# Altium project PROC106B.PrjPcb (part 2 of 2)

## Sheet PROC106B_FLASH_USB_TO_UART.SchDoc: FLASH&USB_TO_UART
size 431 x 279 mm; Date: Not shown in title block; ApprovedBy: Not shown in title block; CheckedBy: Not shown in title block; Author: Not shown in title block; CompanyName: Not shown in title block; DrawnBy: Antony/Anand Ram; Engineer: Not shown in title block; Organization: Not shown in title block; Address1: Not shown in title block; Address2: Not shown in title block; Address3: Not shown in title block; Address4: Not shown in title block; DocumentNumber: 6; Revision: Use project parameter SCH_Rev; SheetNumber: 6; SheetTotal: 12; PageSetup: Record=PageOptions|CenterHorizontal=True|CenterVertical=True|PrintScale=1.00|XCorrection=1.00|YCorrection=1.00|PrintKind=0|BorderSize=5000000|LeftOffset=0|BottomOffset=0|Orientation=2|PaperLength=1000|PaperWidth=1000|Scale=100|PaperSource=15|PrintQuality=600|MediaType=1|DitherType=10|PaperKind=Letter|PrintScaleMode=1; CurrentTime: Not shown in title block; CurrentDate: Not shown in title block; Time: Not shown in title block; DocumentFullPathAndName: Not shown in title block; DocumentName: Not shown in title block; ModifiedDate: Not shown in title block; ImagePath: Not shown in title block
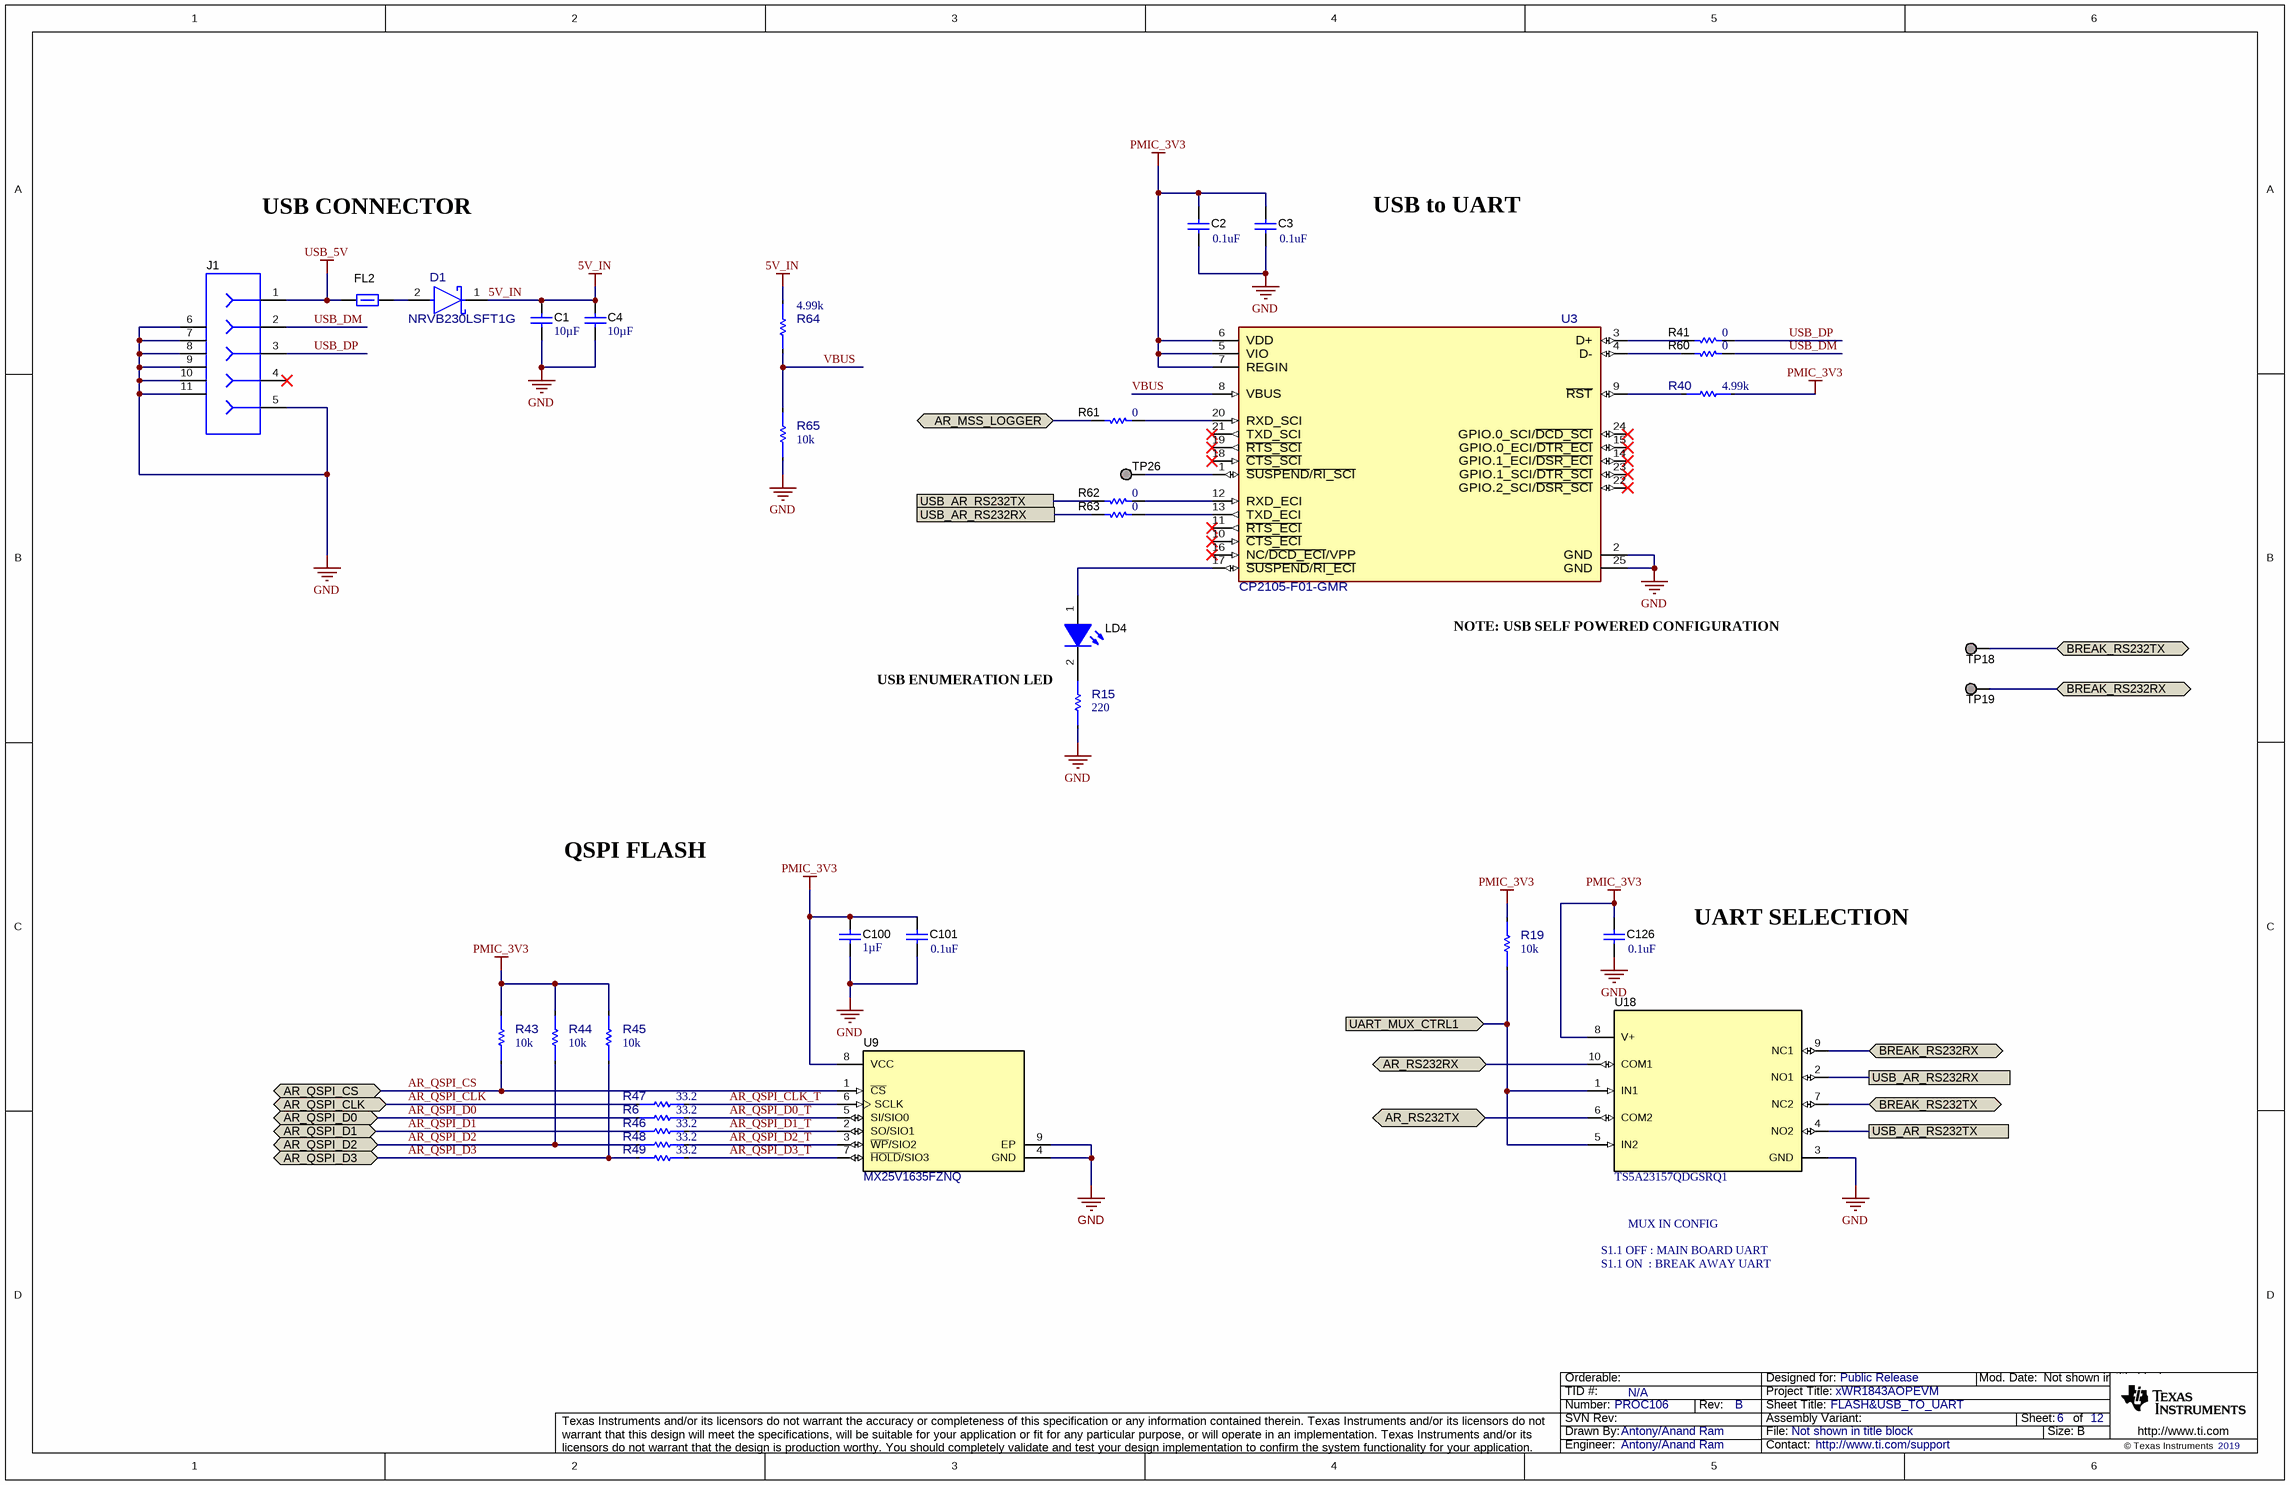
[diagram p2: PROC106B_FLASH_USB_TO_UART.SchDoc]

### Parts
C1  Cap_F: 10µF  [0805L]  (hidden comment: GCM21BR71A106KE22L)
C2  ValueDisplayed: 0.1uF  [0402L]  (hidden comment: GCM155R71C104KA55D)
C3  ValueDisplayed: 0.1uF  [0402L]  (hidden comment: GCM155R71C104KA55D)
C4  Cap_F: 10µF  [0805L]  (hidden comment: GCM21BR71A106KE22L)
C100  Cap_F: 1µF  [0603L]  (hidden comment: GCM188R71C105KA64D)
C101  ValueDisplayed: 0.1uF  [0402L]  (hidden comment: GCM155R71C104KA55D)
C126  ValueDisplayed: 0.1uF  [0402L]  (hidden comment: GCM155R71C104KA55D)
D1  NRVB230LSFT1G  [FP-NRVB230LSFT1G_SOD-123F-MFG]
FL2  BLM15PD300SZ1D  [0402L]  (value not drawn)
J1  105017-0001  [CONN_105017-0001]  (value not drawn)
LD4  APHHS1005CGCK  [APHHS1005_Green]  (value not drawn)
R6  value 33.2  [FP-ERJ-1GNF33R2C_0201-IPC_C]  (hidden comment: ERJ-1GNF33R2C)
R15  value 220  [FP-ERJ-1GNJ221C_0201-IPC_C]  (hidden comment: ERJ-1GNJ221C)
R19  value 10k  [FP-ERA-1AEB103C_0201-IPC_C]  (hidden comment: ERA-1AEB103C)
R40  value 4.99k  [FP-ERJ-1GNF4991C_0201-IPC_C]  (hidden comment: ERJ-1GNF4991C)
R41  ValueDisplayed: 0  [0201L]  (hidden comment: ERJ-1GN0R00C)
R43  value 10k  [FP-ERA-1AEB103C_0201-IPC_C]  (hidden comment: ERA-1AEB103C)
R44  value 10k  [FP-ERA-1AEB103C_0201-IPC_C]  (hidden comment: ERA-1AEB103C)
R45  value 10k  [FP-ERA-1AEB103C_0201-IPC_C]  (hidden comment: ERA-1AEB103C)
R46  value 33.2  [FP-ERJ-1GNF33R2C_0201-IPC_C]  (hidden comment: ERJ-1GNF33R2C)
R47  value 33.2  [FP-ERJ-1GNF33R2C_0201-IPC_C]  (hidden comment: ERJ-1GNF33R2C)
R48  value 33.2  [FP-ERJ-1GNF33R2C_0201-IPC_C]  (hidden comment: ERJ-1GNF33R2C)
R49  value 33.2  [FP-ERJ-1GNF33R2C_0201-IPC_C]  (hidden comment: ERJ-1GNF33R2C)
R60  ValueDisplayed: 0  [0201L]  (hidden comment: ERJ-1GN0R00C)
R61  ValueDisplayed: 0  [0201L]  (hidden comment: ERJ-1GN0R00C)
R62  ValueDisplayed: 0  [0201L]  (hidden comment: ERJ-1GN0R00C)
R63  ValueDisplayed: 0  [0201L]  (hidden comment: ERJ-1GN0R00C)
R64  value 4.99k  [FP-ERJ-1GNF4991C_0201-IPC_C]  (hidden comment: ERJ-1GNF4991C)
R65  value 10k  [FP-ERA-1AEB103C_0201-IPC_C]  (hidden comment: ERA-1AEB103C)
TP18  TESTPOINT  [TP_25MIL-SMT]  (value not drawn)  (no BOM)
TP19  TESTPOINT  [TP_25MIL-SMT]  (value not drawn)  (no BOM)
TP26  TESTPOINT  [TP_25MIL-SMT]  (value not drawn)  (no BOM)
U3  CP2105-F01-GMR  [FP-CP2105-F01-GMR_QFN24-EP-IPC_A]
U9  MX25V1635FZNQ  [WSON-8L_6x5MM_EP]
U18  TS5A23157QDGSRQ1  [DGS0010A_L]

### Ports
AR_MSS_LOGGER (bidir), AR_QSPI_CLK (bidir), AR_QSPI_CS (bidir), AR_QSPI_D0 (bidir), AR_QSPI_D1 (bidir), AR_QSPI_D2 (bidir), AR_QSPI_D3 (bidir), AR_RS232RX (bidir), AR_RS232TX (bidir), BREAK_RS232RX (bidir), BREAK_RS232TX (bidir), UART_MUX_CTRL1 (in), USB_AR_RS232RX, USB_AR_RS232TX

### Nets
5V_IN: C1.2 C4.1 D1.1(CATHODE) R64.1
GND: C1.1 C2.2 C3.2 C4.2 C100.1 C101.1 C126.1 J1.5 J1.6 J1.7 J1.8 J1.9 J1.10 J1.11 R15.1 R65.1 U3.2(GND) U3.25(GND) U9.4(GND) U9.9(EP) U18.3(GND)
PMIC_3V3: C2.1 C3.1 C100.2 C101.2 C126.2 R19.2 R40.1 R43.2 R44.2 R45.2 U3.5(VIO) U3.6(VDD) U3.7(REGIN) U9.8(VCC) U18.8(V+)
USB_5V: FL2.1 J1.1
AR_MSS_LOGGER: R61.1 ; port AR_MSS_LOGGER
AR_QSPI_CLK: R47.1 ; port AR_QSPI_CLK
AR_QSPI_CLK_T: R47.2 U9.6(SCLK)
AR_QSPI_CS: R43.1 U9.1(~{CS}) ; port AR_QSPI_CS
AR_QSPI_D0: R6.1 ; port AR_QSPI_D0
AR_QSPI_D0_T: R6.2 U9.5(SI/SIO0)
AR_QSPI_D1: R46.1 ; port AR_QSPI_D1
AR_QSPI_D1_T: R46.2 U9.2(SO/SIO1)
AR_QSPI_D2: R44.1 R48.1 ; port AR_QSPI_D2
AR_QSPI_D2_T: R48.2 U9.3(~{WP}/SIO2)
AR_QSPI_D3: R45.1 R49.1 ; port AR_QSPI_D3
AR_QSPI_D3_T: R49.2 U9.7(~{HOLD}/SIO3)
AR_RS232RX: U18.10(COM1) ; port AR_RS232RX
AR_RS232TX: U18.6(COM2) ; port AR_RS232TX
BREAK_RS232RX: TP19.1 U18.9(NC1) ; port BREAK_RS232RX
BREAK_RS232TX: TP18.1 U18.7(NC2) ; port BREAK_RS232TX
UART_MUX_CTRL1: R19.1 U18.1(IN1) U18.5(IN2) ; port UART_MUX_CTRL1
USB_AR_RS232RX: R63.1 U18.2(NO1) ; port USB_AR_RS232RX
USB_AR_RS232TX: R62.1 U18.4(NO2) ; port USB_AR_RS232TX
USB_DM: J1.2 R60.2
USB_DP: J1.3 R41.2
VBUS: R64.2 R65.2 U3.8(VBUS)
NetD1_2: D1.2(ANODE) FL2.2
NetLD4_1: LD4.1(A) U3.17(~{SUSPEND}/~{RI_ECI})
NetLD4_2: LD4.2(K) R15.2
NetR40_2: R40.2 U3.9(~{RST})
NetR41_1: R41.1 U3.3(D+)
NetR60_1: R60.1 U3.4(D-)
NetR61_2: R61.2 U3.20(RXD_SCI)
NetR62_2: R62.2 U3.12(RXD_ECI)
NetR63_2: R63.2 U3.13(TXD_ECI)
NetTP26_1: TP26.1 U3.1(~{SUSPEND}/~{RI_SCI})

Not connected (* = marked no-connect by the designer): J1 4*; U3 10(~{CTS_ECI})* 11(~{RTS_ECI})* 14(GPIO.1_ECI/~{DSR_ECI})* 15(GPIO.0_ECI/~{DTR_ECI})* 16(NC/~{DCD_ECI}/VPP)* 18(~{CTS_SCI})* 19(~{RTS_SCI})* 21(TXD_SCI)* 22(GPIO.2_SCI/~{DSR_SCI})* 23(GPIO.1_SCI/~{DTR_SCI})* 24(GPIO.0_SCI/~{DCD_SCI})*

### Notes on the sheet
- USB CONNECTOR
- USB to UART
- (near U3) NOTE: USB SELF POWERED CONFIGURATION
- USB ENUMERATION LED
- QSPI FLASH
- UART SELECTION
- MUX IN CONFIG
- S1.1 ON  : BREAK AWAY UART
- S1.1 OFF : MAIN BOARD UART
- Drawn By:
- SVN Rev:
- Number:
- TID #:
- Orderable:
- Rev:
- Sheet Title:
- File:
- Project Title:
- Designed for:
- Assembly Variant:
- Mod. Date:
- Sheet:
- Size:
- of
- B
- http://www.ti.com
- Texas Instruments and/or its licensors do not warrant the accuracy or completeness of this specification or any information contained therein. Texas Instruments and/or its licensors do not warrant that this design will meet the specifications, will be suitable for your application or fit for any particular purpose, or will operate in an implementation. Texas Instruments and/or its licensors do not warrant that the design is production worthy. You should completely validate and test your design implementation to confirm the system functionality for your application.
- Engineer:
- Contact:
- © Texas Instruments

### Library data of the parts
C1 C4 = CMP-0008017-2: CAP, CERM, 10 uF, 10 V, +/- 10%, X7R, 0805; Manufacturer: MuRata; Value: 10uF; AEC Category: Q200; Cap_Case: 0805; Polarized: N; SizeArea_mm2: 2.5; SizeAreaWB_mm2: 6.75; SizeX_mm: 2; SizeY_mm: 1.25; SizeZ_mm: 1.45; TaMax_C: 125°C; TaMin_C: -55°C; U/M: EA; Value1: Unknown; Value2: 10V; RoHS: Y; AEC Qualified: ?; ComponentLink1Description: Datasheet link; ComponentLink1URL: http://www.murata.com/products/catalog/pdf/c03e.pdf; CompType: Capacitor; MountType: SMT; PackageReference: 0805; PartNumber: GCM21BR71A106KE22L; Supplier 1: Digi-Key; Supplier 2: Newark; Supplier 3: Mouser; Supplier Part Number 1: 490-10674-1-ND; Supplier Part Number 2: 06AC6014; Supplier Part Number 3: 81-GCM21BR71A106KE2L; Technology: Ceramic; TempCo: X7R; Tolerance_%: 10%; ValueDisplayed: 10uF; VDC_V: 10V; LatestRevisionDate: 2017-03-09; Published: 2008-06-19; Publisher: Texas Instruments
C2 C3 C101 C126 = CMP-0006351-2: CAP, CERM, 0.1 uF, 16 V, +/- 10%, X7R, 0402; Manufacturer: MuRata; Cap_F: 100nF; SizeZ_mm: 0.6; VDC_V: 16V; AEC Category: Q200; Cap_Case: 0402; Polarized: N; SizeArea_mm2: 0.5; SizeAreaWB_mm2: 3; SizeX_mm: 1; TaMax_C: 125°C; TaMin_C: -55°C; U/M: EA; Value1: Unknown; Value: 0.1uF; RoHS: Y; AEC Qualified: ?; ComponentLink1Description: Datasheet link; ComponentLink1URL: http://psearch.murata.com/capacitor/product/GCM155R71C104KA55%23.pdf; PackageReference: 0402; PartNumber: GCM155R71C104KA55D; TempCo: X7R; Tolerance_%: 10%; CompType: Capacitor; MountType: SMT; SizeY_mm: 0.5; Supplier 1: Digi-Key; Supplier Part Number 1: 490-4759-2-ND; Technology: Ceramic; Value2: 16V; LatestRevisionDate: 2017-03-09; Published: 2008-06-19; Publisher: Texas Instruments
C100 = CMP-0007136-5: CAP, CERM, 1 uF, 16 V, +/- 10%, X7R, AEC-Q200 Grade 1, 0603; Manufacturer: MuRata; AEC Qualified: Y; SizeZ_mm: 1; VDC_V: 16V; AEC Category: Q200; Cap_Case: 0603; Polarized: N; SizeArea_mm2: 1.28; SizeAreaWB_mm2: 4.68; SizeX_mm: 1.6; SizeY_mm: 0.8; TaMax_C: 125°C; TaMin_C: -55°C; U/M: EA; Value1: Unknown; Value: 1uF; RoHS: Y; ComponentLink1Description: Datasheet link; ComponentLink1URL: http://psearch.en.murata.com/capacitor/product/GCM188R71C105KA64%23.pdf; PackageReference: 0603; PartNumber: GCM188R71C105KA64D; TempCo: X7R; Tolerance_%: 10%; AEC Grade: 1; CompType: Capacitor; MountType: SMT; Supplier 1: Digi-Key; Supplier 2: Mouser; Supplier Part Number 1: 490-5241-6-ND; Supplier Part Number 2: 81-GCM188R71C105K64D; Technology: Ceramic; Value2: 16V; ValueDisplayed: 1uF; LatestRevisionDate: 2017-03-09; Published: 2008-06-19; Publisher: Texas Instruments
D1 = CMP-0090508-1: Diode Schottky 30V 2A Surface Mount SOD-123FL; Manufacturer: ON Semiconductor; TJmax_C: 125°C; SizeZ_mm: 0.98mm; AEC Qualified: Yes; AEC Grade: Grade 1; Max Surge Forward Current: 40A; Peak Reverse Current: 1mA; Standoff Height: 0mm; PackageReference: SOD-123F; RoHS: TRUE; PartNumber: NRVB230LSFT1G; ComponentLink1Description: Datasheet; Vr_V: 30V; ComponentLink1URL: https://www.onsemi.com/pub/Collateral/MBR230LSFT1-D.PDF; Vf_V: 30V; datasheet: https://www.onsemi.com/pub/Collateral/MBR230LSFT1-D.PDF; Datasheet Path: datasheets/Diode-NRVB230LSFT1G.pdf; Digikey Description: DIODE SCHOTTKY 30V 2A SOD123FL; Digikey Part Number: NRVB230LSFT1GOSCT-ND; Forward Current: 2A; helpURL: https://upverter.com/upn/revision/b5ae5ffadf60f179/; Lead Free: Yes; Mouser Description: Schottky Diodes & Rectifiers 2A 30V SCHOTTKY; Mouser Part Number: 863-NRVB230LSFT1G; Operating Temperature Range: -55°C to +125°C; Part Number: NRVB230LSFT1G
FL2 = CMP-0078934-1: Inductor, Ferrite Bead, Ferrite, 2.2 A, 0.035 ohm, AEC-Q200 Grade 1, SMD; Manufacturer: MuRata; AEC Category: Q200; AEC Grade: 1; AEC Qualified: Y; DCR_ohm: 0.035; Imax_A: 2.2A; SizeArea_mm2: 0.5; SizeAreaWB_mm2: 3; SizeZ_mm: 0.6; RoHS: Y; ComponentLink1Description: Datasheet link; ComponentLink1URL: https://www.murata.com/en-us/products/productdata/8796748677150/QNFA9118.pdf; CompType: Inductor; LatestRevisionDate: 2017-12-07; Material: Ferrite; MountType: SMT; PackageReference: 0402; PartNumber: BLM15PD300SZ1D; Published: 2008-06-26; Publisher: Texas Instruments; SizeX_mm: 1; SizeY_mm: 0.5; Supplier 1: Digi-Key; Supplier 2: Mouser; Supplier Part Number 1: 490-16506-1-ND; Supplier Part Number 2: 81-BLM15PD300SZ1D; Technology: Ferrite Bead; Value1: 0.035 ohm; Value2: 2.2A
J1 = CMP-0055293-1: Connector, Receptacle, Micro-USB Type B, R/A, Bottom Mount SMT; Manufacturer: Molex; CNHeader: FALSE; CompType: USB; CT: TRUE; Gender: Female; Green_Lifecycle: Active; Green_REACh: Passed; RoHS: Y; ComponentLink1Description: Datasheet URL; ComponentLink1URL: http://www.molex.com/pdm_docs/sd/1050170001_sd.pdf; Green_EU RoHS-2: Passed; Green_EU RoHS: Passed; LatestRevisionDate: 26/05/2017; MountType: SMT; PackageReference: Micro USB receptacle; PartNumber: 105017-0001; Publisher: Texas Instruments; Supplier 1: Digi-Key; Supplier 2: Newark; Supplier 3: Mouser; Supplier Part Number 1: WM1399CT-ND; Supplier Part Number 2: 78R1699; Supplier Part Number 3: 538-105017-0001
LD4 = CMP-0067682-2: LED, Green, SMD; Manufacturer: Kingbright; Angle: 120.0; Power_TotalModule: 75mW; SizeZ_mm: 0.6; Vf_V: 2.1V; Vr_V: 5V; Io_A: 20mA; Ir_A: 10µA; SizeArea_mm2: 0.5; SizeAreaWB_mm2: 3.0; SizeX_mm: 1.0; Tjmax_C: 85°C; Value1: 0.075W; RoHS: Y; Color: Green; ComponentLink1Description: Datasheet link; ComponentLink1URL: http://www.kingbrightusa.com/images/catalog/SPEC/APHHS1005CGCK.pdf; PackageReference: 0402; PartNumber: APHHS1005CGCK; CompType: LED; MountType: SMT; SizeY_mm: 0.5; Type: ?; Value2: 2.1V; Value: Green
R6 R46-R49 = CMP-0089575-2: Res Thick Film 0201 33.2 Ohm 1% 0.05W(1/20W) ±200ppm/C Pad SMD Automotive T/R; Manufacturer: Panasonic; AEC Grade: Grade 1; AEC Qualified: Yes; Power_W: 50mW; SizeZ_mm: 0.26mm; TempCo: 200ppm/°C; VDC_V: 25V; RoHS: TRUE; ComponentLink1Description: Datasheet; ComponentLink1URL: https://industrial.panasonic.com/cdbs/www-data/pdf/RDA0000/AOA0000C304.pdf; PackageReference: 0201; PartNumber: ERJ-1GNF33R2C; Res_ohm: 33.2; Supplier 1: Digikey; Supplier 2: Mouser; Supplier Part Number 1: P122945CT-ND; Supplier Part Number 2: 667-ERJ-1GNF33R2C; Technology: Thick Film; Tolerance_%: 1%; datasheet: https://industrial.panasonic.com/cdbs/www-data/pdf/RDA0000/AOA0000C304.pdf; Datasheet Path: datasheets/Res-ERJ-1GNF33R2C.pdf; Digikey Description: RES SMD 33.2 OHM 1% 1/20W 0201; Digikey Part Number: P122945CT-ND; helpURL: https://upverter.com/upn/revision/804e6f7ea13c6b2c/; Lead Free: Yes; Mouser Description: Thick Film Resistors - SMD 0201 33.2ohm 1% HalogenFree AEC-Q200; Mouser Part Number: 667-ERJ-1GNF33R2C; Operating Temperature Range: -55°C to +125°C; Part Number: ERJ-1GNF33R2C; Series: ERJ
R15 = CMP-0090501-1: 220 Ohms ±5% 0.05W, 1/20W Chip Resistor 0201 (0603 Metric) Automotive AEC-Q200 Thick Film; Manufacturer: Panasonic Electronic Components; AEC Grade: Grade 1; AEC Qualified: Yes; Power_W: 50mW; SizeZ_mm: 0.26mm; TempCo: 200ppm/°C; VDC_V: 25V; RoHS: TRUE; ComponentLink1Description: Datasheet; ComponentLink1URL: https://industrial.panasonic.com/cdbs/www-data/pdf/RDA0000/AOA0000C301.pdf; PackageReference: 0201; PartNumber: ERJ-1GNJ221C; Res_ohm: 220; Supplier 1: Digikey; Supplier 2: Mouser; Supplier Part Number 1: P123276CT-ND; Supplier Part Number 2: 667-ERJ-1GNJ221C; Technology: Thick Film; Tolerance_%: 5%; datasheet: https://industrial.panasonic.com/cdbs/www-data/pdf/RDA0000/AOA0000C301.pdf; Datasheet Path: datasheets/Res-ERJ-1GNJ221C.pdf; Digikey Description: RES SMD 220 OHM 5% 1/20W 0201; Digikey Part Number: P123276CT-ND; helpURL: https://upverter.com/upn/revision/fb526d048c4bdd68/; Lead Free: Yes; Mouser Description: Thick Film Resistors - SMD 0201 220ohms 5% Thick Film Resistor; Mouser Part Number: 667-ERJ-1GNJ221C; Operating Temperature Range: -55°C to +125°C; Part Number: ERJ-1GNJ221C; Series: ERJ
R19 R43-R45 R65 = CMP-0090084-1: RES SMD 10K OHM 0.1% 1/20W 0201; Manufacturer: Panasonic; AEC Qualified: No; Power_W: 50mW; SizeZ_mm: 0.26mm; TempCo: 25ppm/°C; VDC_V: 25V; RoHS: TRUE; ComponentLink1Description: Datasheet; ComponentLink1URL: https://industrial.panasonic.com/cdbs/www-data/pdf/RDM0000/AOA0000C307.pdf; PackageReference: 0201; PartNumber: ERA-1AEB103C; Res_ohm: 10k; Technology: Thin Film; Tolerance_%: 0.1%; datasheet: https://industrial.panasonic.com/cdbs/www-data/pdf/RDM0000/AOA0000C307.pdf; Datasheet Path: datasheets/Res-ERA-1AEB103C.pdf; Digikey Description: RES SMD 10K OHM 0.1% 1/20W 0201; Digikey Part Number: P10KBXCT-ND; helpURL: https://upverter.com/upn/revision/ad75fa42d92ba837/; Lead Free: Yes; Mouser Part Number: 667-ERA-1AEB103C; Operating Temperature Range: -55°C to +155°C; Part Number: ERA-1AEB103C; Series: ERA; Supplier 1: Digikey; Supplier 2: Mouser; Supplier Part Number 1: P10KBXCT-ND; Supplier Part Number 2: 667-ERA-1AEB103C
R40 R64 = CMP-0090497-1: 4.99 kOhms ±1% 0.05W, 1/20W Chip Resistor 0201 (0603 Metric) Automotive AEC-Q200 Thick Film; Manufacturer: Panasonic Electronic Components; AEC Grade: Grade 1; AEC Qualified: Yes; Power_W: 50mW; SizeZ_mm: 0.26mm; TempCo: 200ppm/°C; VDC_V: 25V; RoHS: TRUE; ComponentLink1Description: Datasheet; ComponentLink1URL: https://industrial.panasonic.com/cdbs/www-data/pdf/RDA0000/AOA0000C304.pdf; PackageReference: 0201; PartNumber: ERJ-1GNF4991C; Res_ohm: 4.99k; Supplier 1: Digikey; Supplier 2: Mouser; Supplier Part Number 1: P123046CT-ND; Supplier Part Number 2: 667-ERJ-1GNF4991C; Technology: Thick Film; Tolerance_%: 1%; datasheet: https://industrial.panasonic.com/cdbs/www-data/pdf/RDA0000/AOA0000C304.pdf; Datasheet Path: datasheets/Res-ERJ-1GNF4991C.pdf; Digikey Description: RES SMD 4.99K OHM 1% 1/20W 0201; Digikey Part Number: P123046CT-ND; helpURL: https://upverter.com/upn/revision/2e32c60b077f8dd5/; Lead Free: Yes; Mouser Description: Thick Film Resistors - SMD 0201 4.99Kohm 1% HalogenFree AEC-Q200; Mouser Part Number: 667-ERJ-1GNF4991C; Operating Temperature Range: -55°C to +125°C; Part Number: ERJ-1GNF4991C; Series: ERJ
R41 R60-R63 = CMP-0065361-1: RES, 0, 5%, .05 W, AEC-Q200 Grade 0, 0201; Manufacturer: Panasonic; AEC Qualified: Y; Power_W: 50mW; SizeZ_mm: 0.26; TempCo: ppm/C; AEC Category: Q200; EIA_Code: E24; Green_Lifecycle: Not Set; Green_REACh: Incomplete; SizeArea_mm2: 0.18; SizeX_mm: 0.6; SizeY_mm: 0.3; U/M: EA; Value2: .05W; Value: 0; Value_Code: 0000; RoHS: Y; ComponentLink1Description: Datasheet link; ComponentLink1URL: https://industrial.panasonic.com/cdbs/www-data/pdf/RDA0000/AOA0000C281.pdf; PackageReference: 0201; PartNumber: ERJ-1GN0R00C; Res_ohm: 0; Technology: Thick Film; Tolerance_%: 5%; AEC Grade: 0; CompType: Resistor; Green_EU RoHS-2: Incomplete; Green_EU RoHS: Incomplete; LatestRevisionDate: 2017-06-05; MountType: SMT; Published: 2016-10-14; Publisher: Texas Instruments; Supplier 1: Digi-Key; Supplier 2: Newark; Supplier 3: Mouser; Supplier Part Number 1: P15979CT-ND; Supplier Part Number 2: 51W5934; Supplier Part Number 3: 667-ERJ-1GN0R00C; Value1: 5%
TP18 TP19 TP26 = CMP-0078143-3: TEST POINT.  No entry in BOM.; CompType: Testpoint; Manufacturer: N/A; PackageReference: N/A; PartNumber: N/A; Library Reference: TESTPOINT
U3 = CMP-0087172-1: I/O Controller Interface IC USB to Dual UART bridge; Manufacturer: Silicon Labs; SizeZ_mm: 0.8mm; RoHS: TRUE; ComponentLink1Description: Datasheet; ComponentLink1URL: https://www.silabs.com/documents/public/data-sheets/CP2105.pdf; PackageReference: QFN24-EP; PartNumber: CP2105-F01-GMR; Symbol Name: SYM-CP2105-F01-GMR
U9 = CMP-0079267-1: 2.3V-3.6V, 16M-BIT [x 1/x 2/x 4] CMOS FLASH Memory, WSON-8; Manufacturer: Macronix International Co., LTD; SizeArea_mm2: 30; SizeAreaWB_mm2: 56; SizeX_mm: 6; SizeY_mm: 5; SizeZ_mm: 0.8; RoHS: Y; ComponentLink1Description: Datasheet URL; ComponentLink1URL: http://www.macronix.com/Lists/Datasheet/Attachments/6724/MX25V1635F,%202.5V,%2016Mb,%20v1.4.pdf; MountType: SMT; PackageReference: WSON-8; PartNumber: MX25V1635FZNQ; Supplier 1: Digi-Key; Supplier Part Number 1: 1092-1211-ND
U18 = CMP-0074341-1: Automotive Catalog Dual 15-Ohm SPDT Analog Switch, DGS0010A (VSSOP-10); Alternate Manufacturer: Texas Instruments; CompType: IC; SizeArea_mm2: 14.7; SizeAreaWB_mm2: 23.6; SizeX_mm: 4.9; SizeY_mm: 3.0; SizeZ_mm: 1.1; U/M: EA; RoHS: Y; ComponentLink1Description: Datasheet Link; ComponentLink1URL: http://www.ti.com/lit/ds/symlink/ts5a23157-q1.pdf; Footprint Path 6: C:\AltiumLibraries\Footprints\TI\.PcbLib; LatestRevisionDate: 2017-06-09; Manufacturer: Texas Instruments; MountType: SMT; PackageDescription: VSSOP-10; PackageReference: DGS0010A; PartNumber: TS5A23157QDGSRQ1; Publisher: Texas Instruments

## Sheet PROC106B_RST_GPIOs_I2C.SchDoc: BREAKAWAY_SECTION2
size 431 x 279 mm; Date: Not shown in title block; ApprovedBy: Not shown in title block; CheckedBy: Not shown in title block; Author: Not shown in title block; CompanyName: Not shown in title block; DrawnBy: Antony/Anand Ram; Engineer: Not shown in title block; Organization: Not shown in title block; Address1: Not shown in title block; Address2: Not shown in title block; Address3: Not shown in title block; Address4: Not shown in title block; DocumentNumber: 8; Revision: Use project parameter SCH_Rev; SheetNumber: 8; SheetTotal: 12; PageSetup: Record=PageOptions|CenterHorizontal=True|CenterVertical=True|PrintScale=1.00|XCorrection=1.00|YCorrection=1.00|PrintKind=0|BorderSize=5000000|LeftOffset=0|BottomOffset=0|Orientation=2|PaperLength=1000|PaperWidth=1000|Scale=100|PaperSource=15|PrintQuality=600|MediaType=1|DitherType=10|PaperKind=Letter|PrintScaleMode=1; CurrentTime: Not shown in title block; CurrentDate: Not shown in title block; Time: Not shown in title block; DocumentFullPathAndName: Not shown in title block; DocumentName: Not shown in title block; ModifiedDate: Not shown in title block; ImagePath: Not shown in title block
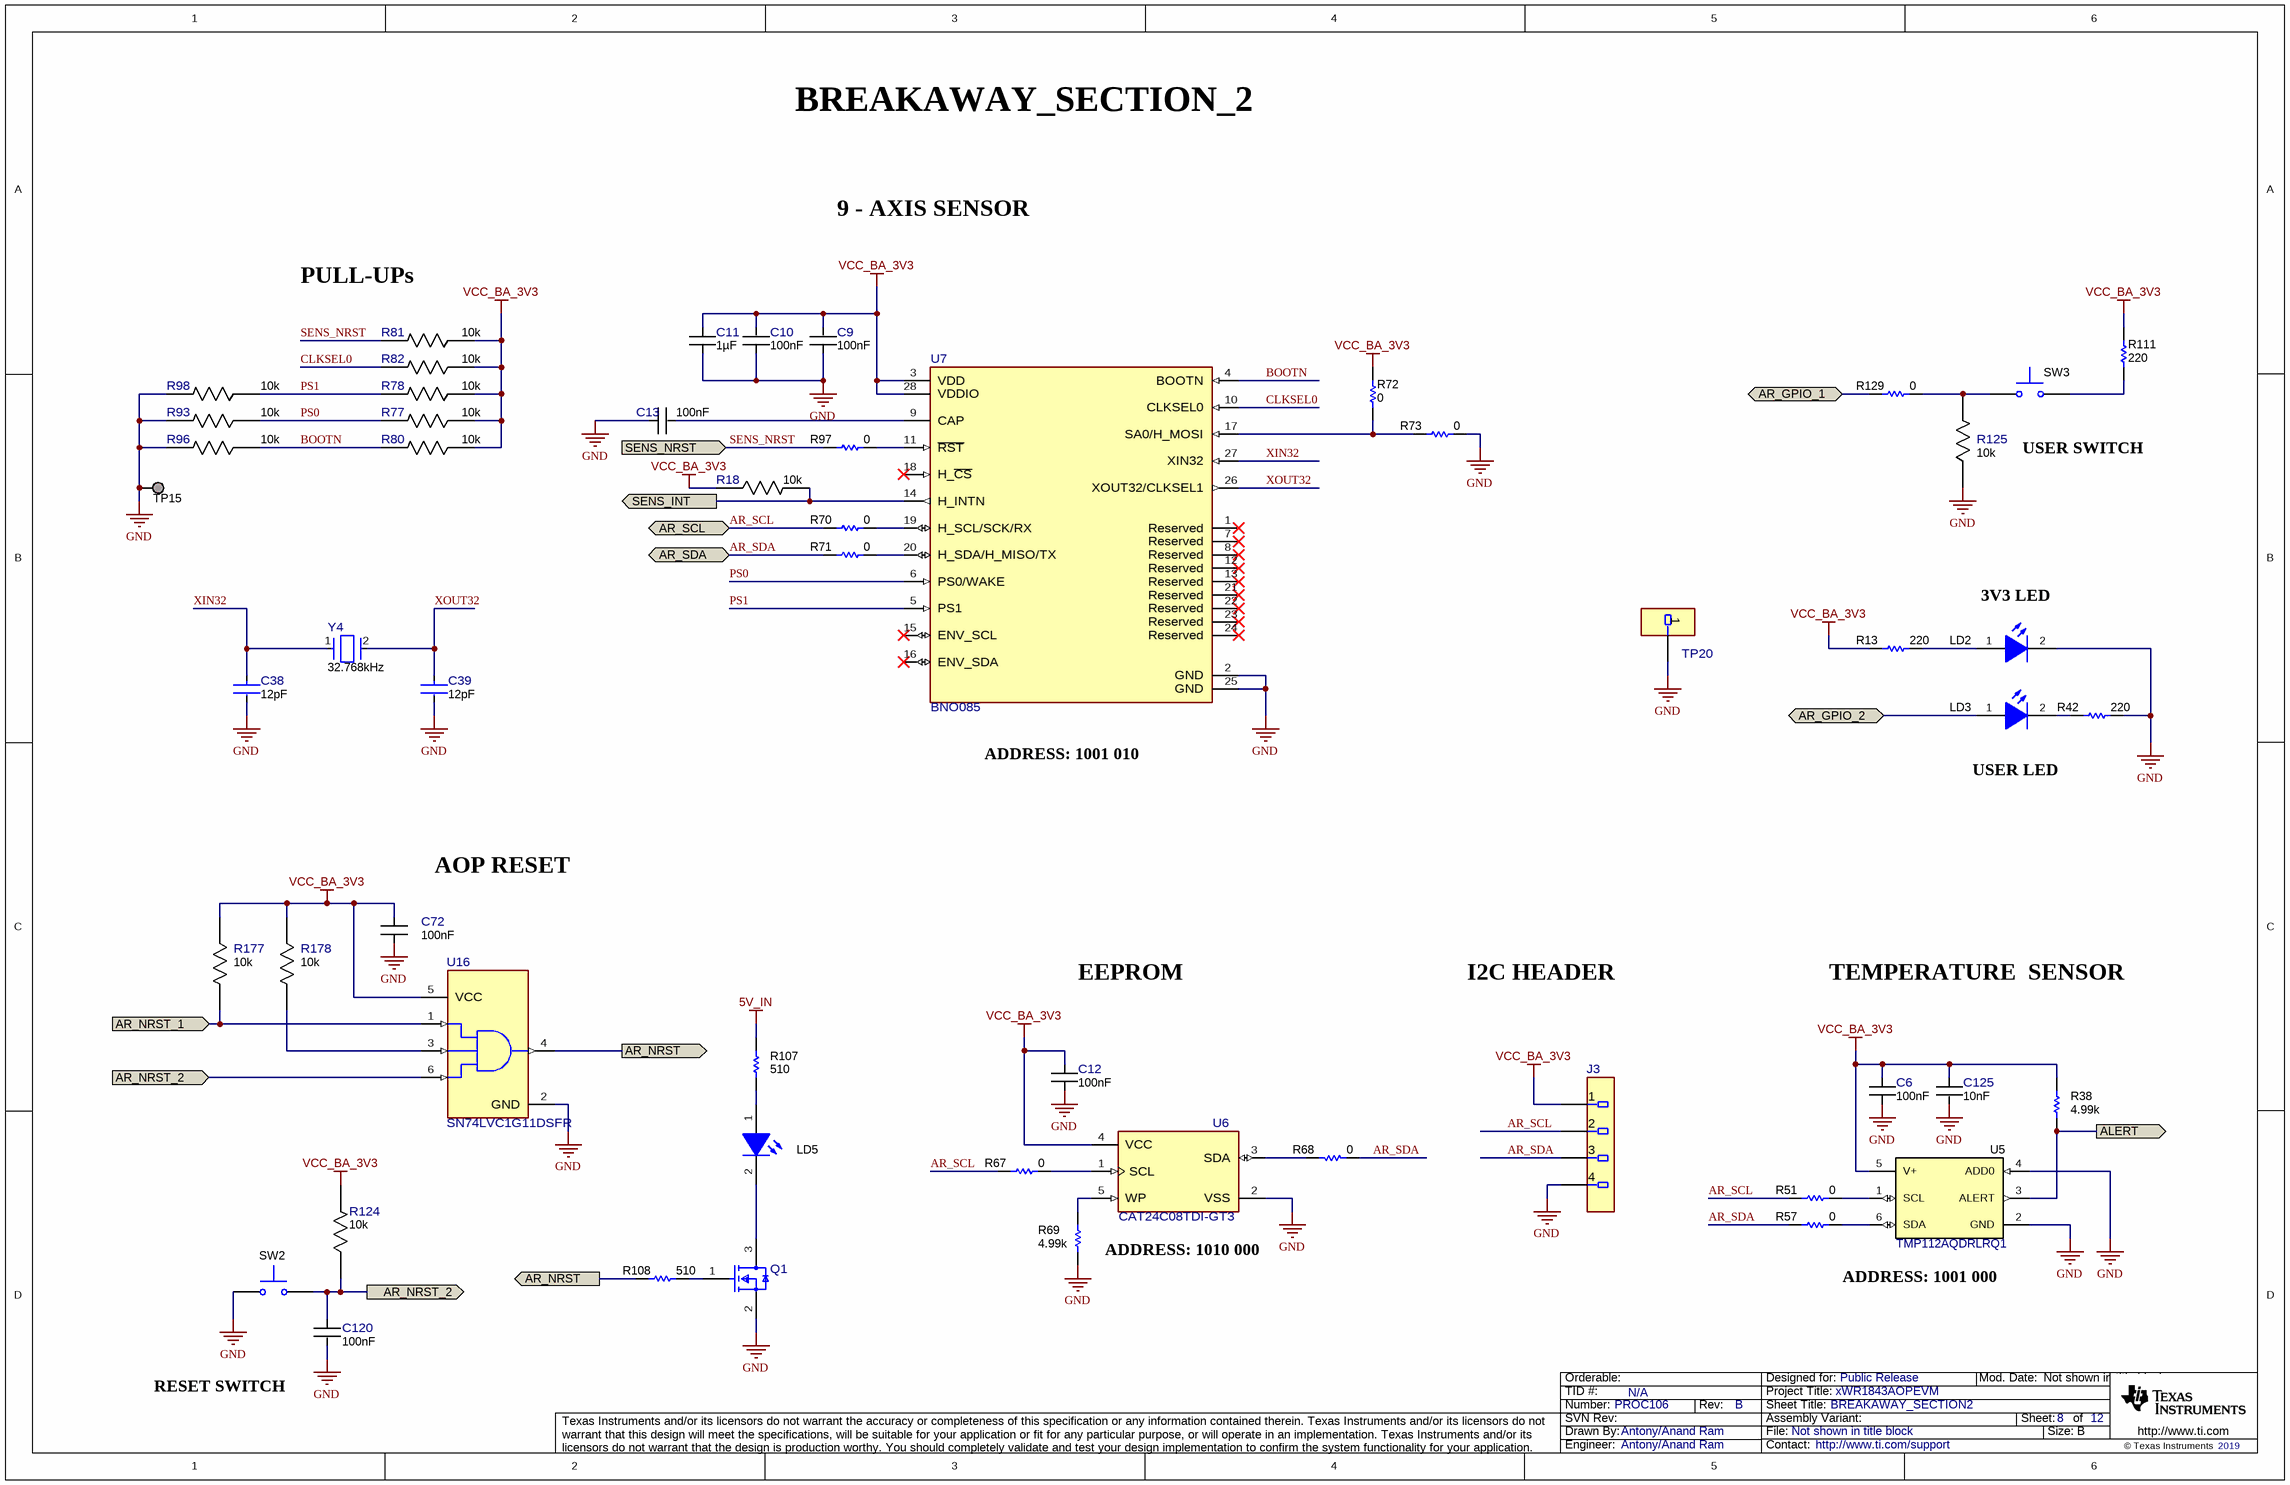
[diagram p3: PROC106B_RST_GPIOs_I2C.SchDoc]

### Parts
C6  Cap_F: 100nF  [FP-GRM033R6YA104KE14D_0201 (0603 Metric)-IPC_C]  (hidden comment: GRM033R6YA104KE14D)
C9  Cap_F: 100nF  [FP-GRM033R6YA104KE14D_0201 (0603 Metric)-IPC_C]  (hidden comment: GRM033R6YA104KE14D)
C10  Cap_F: 100nF  [FP-GRM033R6YA104KE14D_0201 (0603 Metric)-IPC_C]  (hidden comment: GRM033R6YA104KE14D)
C11  Cap_F: 1µF  [FP-CL03A105MO3NRNH_0201-IPC_C]  (hidden comment: CL03A105MO3NRNH)
C12  Cap_F: 100nF  [FP-GRM033R6YA104KE14D_0201 (0603 Metric)-IPC_C]  (hidden comment: GRM033R6YA104KE14D)
C13  Cap_F: 100nF  [FP-GRM033R6YA104KE14D_0201 (0603 Metric)-IPC_C]  (hidden comment: GRM033R6YA104KE14D)
C38  Cap_F: 12pF  [FP-250R05L120JV4T_0201-IPC_C]  (hidden comment: 250R05L120JV4T)
C39  Cap_F: 12pF  [FP-250R05L120JV4T_0201-IPC_C]  (hidden comment: 250R05L120JV4T)
C72  Cap_F: 100nF  [FP-GRM033R6YA104KE14D_0201 (0603 Metric)-IPC_C]  (hidden comment: GRM033R6YA104KE14D)
C120  Cap_F: 100nF  [FP-GRM033R6YA104KE14D_0201 (0603 Metric)-IPC_C]  (hidden comment: GRM033R6YA104KE14D)
C125  Cap_F: 10nF  [FP-CL03A103KA3NNNC_0201-IPC_C]  (hidden comment: CL03A103KA3NNNC)
J3  M50-3930442  [FP-M50-3930442_HDR4-Recommended_Land_Pattern]  (value not drawn)
LD2  APHHS1005CGCK  [APHHS1005_Green]  (value not drawn)
LD3  APHHS1005CGCK  [APHHS1005_Green]  (value not drawn)
LD5  APHHS1005CGCK  [APHHS1005_Green]  (value not drawn)
Q1  BSS123-7-F  [FP-BSS123-7-F_SOT23-IPC_C]  (value not drawn)
R13  value 220  [0201L]  (hidden comment: RC0201JR-07220RL)
R18  Res_ohm: 10k  [FP-RR0306P-103-D_0201-IPC_C]  (hidden comment: RR0306P-103-D)
R38  value 4.99k  [0201L]  (hidden comment: RC0201FR-074K99L)
R42  value 220  [0201L]  (hidden comment: RC0201JR-07220RL)
R51  Res_ohm: 0  [FP-RC0201JR-070RL_0201 (0603 Metric)-MFG]  (hidden comment: RC0201JR-070RL)
R57  Res_ohm: 0  [FP-RC0201JR-070RL_0201 (0603 Metric)-MFG]  (hidden comment: RC0201JR-070RL)
R67  Res_ohm: 0  [FP-RC0201JR-070RL_0201 (0603 Metric)-MFG]  (hidden comment: RC0201JR-070RL)
R68  Res_ohm: 0  [FP-RC0201JR-070RL_0201 (0603 Metric)-MFG]  (hidden comment: RC0201JR-070RL)
R69  value 4.99k  [0201L]  (hidden comment: RC0201FR-074K99L)
R70  Res_ohm: 0  [FP-RC0201JR-070RL_0201 (0603 Metric)-MFG]  (hidden comment: RC0201JR-070RL)
R71  Res_ohm: 0  [FP-RC0201JR-070RL_0201 (0603 Metric)-MFG]  (hidden comment: RC0201JR-070RL)
R72  Res_ohm: 0  [FP-RC0201JR-070RL_0201 (0603 Metric)-IPC_C]  (hidden comment: RC0201JR-070RL)
R73  Res_ohm: 0  [FP-RC0201JR-070RL_0201 (0603 Metric)-IPC_C]  (hidden comment: RC0201JR-070RL)
R77  Res_ohm: 10k  [FP-RR0306P-103-D_0201-IPC_C]  (hidden comment: RR0306P-103-D)
R78  Res_ohm: 10k  [FP-RR0306P-103-D_0201-IPC_C]  (hidden comment: RR0306P-103-D)
R80  Res_ohm: 10k  [FP-RR0306P-103-D_0201-IPC_C]  (hidden comment: RR0306P-103-D)
R81  Res_ohm: 10k  [FP-RR0306P-103-D_0201-IPC_C]  (hidden comment: RR0306P-103-D)
R82  Res_ohm: 10k  [FP-RR0306P-103-D_0201-IPC_C]  (hidden comment: RR0306P-103-D)
R93  Res_ohm: 10k  [FP-RR0306P-103-D_0201-IPC_C]  (hidden comment: RR0306P-103-D)
R96  Res_ohm: 10k  [FP-RR0306P-103-D_0201-IPC_C]  (hidden comment: RR0306P-103-D)
R97  Res_ohm: 0  [FP-RC0201JR-070RL_0201 (0603 Metric)-IPC_C]  (hidden comment: RC0201JR-070RL)
R98  Res_ohm: 10k  [FP-RR0306P-103-D_0201-IPC_C]  (hidden comment: RR0306P-103-D)
R107  value 510  [0201L]  (hidden comment: RC0201JR-07510RL)
R108  value 510  [0201L]  (hidden comment: RC0201JR-07510RL)
R111  value 220  [0201L]  (hidden comment: RC0201JR-07220RL)
R124  Res_ohm: 10k  [FP-RR0306P-103-D_0201-IPC_C]  (hidden comment: RR0306P-103-D)
R125  Res_ohm: 10k  [FP-RR0306P-103-D_0201-IPC_C]  (hidden comment: RR0306P-103-D)
R129  Res_ohm: 0  [FP-RC0201JR-070RL_0201 (0603 Metric)-IPC_C]  (hidden comment: RC0201JR-070RL)
R177  Res_ohm: 10k  [FP-RR0306P-103-D_0201-IPC_C]  (hidden comment: RR0306P-103-D)
R178  Res_ohm: 10k  [FP-RR0306P-103-D_0201-IPC_C]  (hidden comment: RR0306P-103-D)
SW2  B3U-1000P  [SW_B3U-1000P]  (value not drawn)
SW3  B3U-1000P  [SW_B3U-1000P]  (value not drawn)
TP15  TESTPOINT  [TP_25MIL-SMT]  (value not drawn)  (no BOM)
TP20  4953  [FP-4953_HDR1-MFG]  (value not drawn)
U5  TMP112AQDRLRQ1  [DRL0006A]
U6  CAT24C08TDI-GT3  [FP-CAT24C08TDI-GT3_TSOT-23-5-IPC_A]
U7  BNO085  [FP-BNO085_LGA28-MFG]
U16  SN74LVC1G11DSFR  [DSF0006A-MFG]
Y4  Frequency_Fixed: 32.768kHz  [FP-ABS05W-32.768KHZ-D-2-T_XTAL_SMT_1MM6_1MM0-MFG]  (hidden comment: ABS05W-32.768KHZ-D-2-T)

### Ports
ALERT (out), AR_GPIO_1 (bidir), AR_GPIO_2 (bidir), AR_NRST (out), AR_NRST_1 (in), AR_NRST_2 (in), AR_NRST_2 (out), AR_SCL (bidir), AR_SDA (bidir), SENS_INT (out), SENS_NRST (in)

### Nets
5V_IN: R107.1
GND: C6.1 C9.1 C10.1 C11.2 C12.1 C13.1 C38.2 C39.2 C72.1 C120.2 C125.2 J3.4 LD2.2(K) Q1.2(S) R42.2 R69.1 R73.1 R93.2 R96.2 R98.2 R125.1 SW2.2 TP15.1 TP20.1 U5.2(GND) U5.4(ADD0) U6.2(VSS) U7.2(GND) U7.25(GND) U16.2(GND)
VCC_BA_3V3: C6.2 C9.2 C10.2 C11.1 C12.2 C72.2 C125.1 J3.1 R13.1 R18.1 R38.2 R72.1 R77.1 R78.1 R80.1 R81.1 R82.1 R111.2 R124.2 R177.1 R178.1 U5.5(V+) U6.4(VCC) U7.3(VDD) U7.28(VDDIO) U16.5(VCC)
ALERT: R38.1 U5.3(ALERT) ; port ALERT
AR_GPIO_1: R129.2 ; port AR_GPIO_1
AR_GPIO_2: LD3.1(A) ; port AR_GPIO_2
AR_NRST: R108.1 U16.4(Y) ; port AR_NRST
AR_NRST_1: R177.2 U16.1(A) ; port AR_NRST_1
AR_NRST_2: C120.1 R124.1 SW2.1 U16.6(C) ; port AR_NRST_2
AR_SCL: J3.2 R51.1 R67.1 R70.2 ; port AR_SCL
AR_SDA: J3.3 R57.1 R68.1 R71.2 ; port AR_SDA
BOOTN: R80.2 R96.1 U7.4(BOOTN)
CLKSEL0: R82.2 U7.10(CLKSEL0)
PS0: R77.2 R93.1 U7.6(PS0/WAKE)
PS1: R78.2 R98.1 U7.5(PS1)
SENS_INT: R18.2 U7.14(H_INTN) ; port SENS_INT
SENS_NRST: R81.2 R97.2 ; port SENS_NRST
XIN32: C38.1 U7.27(XIN32) Y4.1
XOUT32: C39.1 U7.26(XOUT32/CLKSEL1) Y4.2
NetC13_2: C13.2 U7.9(CAP)
NetLD2_1: LD2.1(A) R13.2
NetLD3_2: LD3.2(K) R42.1
NetLD5_1: LD5.1(A) R107.2
NetLD5_2: LD5.2(K) Q1.3(D)
NetQ1_1: Q1.1(G) R108.2
NetR51_2: R51.2 U5.1(SCL)
NetR57_2: R57.2 U5.6(SDA)
NetR67_2: R67.2 U6.1(SCL)
NetR68_2: R68.2 U6.3(SDA)
NetR69_2: R69.2 U6.5(WP)
NetR70_1: R70.1 U7.19(H_SCL/SCK/RX)
NetR71_1: R71.1 U7.20(H_SDA/H_MISO/TX)
NetR72_2: R72.2 R73.2 U7.17(SA0/H_MOSI)
NetR97_1: R97.1 U7.11(~{RST})
NetR111_1: R111.1 SW3.2
NetR125_2: R125.2 R129.1 SW3.1
NetR178_2: R178.2 U16.3(B)

Not connected (* = marked no-connect by the designer): U7 1(Reserved)* 7(Reserved)* 8(Reserved)* 12(Reserved)* 13(Reserved)* 15(ENV_SCL)* 16(ENV_SDA)* 18(H_~{CS})* 21(Reserved)* 22(Reserved)* 23(Reserved)* 24(Reserved)*

### Notes on the sheet
- BREAKAWAY_SECTION_2
- 9 - AXIS SENSOR
- PULL-UPs
- (near SW3) USER SWITCH
- (near LD2) 3V3 LED
- ADDRESS: 1001 010
- USER LED
- AOP RESET
- EEPROM
- I2C HEADER
- TEMPERATURE  SENSOR
- ADDRESS: 1010 000
- ADDRESS: 1001 000
- RESET SWITCH
- Drawn By:
- SVN Rev:
- Number:
- TID #:
- Orderable:
- Rev:
- Sheet Title:
- File:
- Project Title:
- Designed for:
- Assembly Variant:
- Mod. Date:
- Sheet:
- Size:
- of
- B
- http://www.ti.com
- Texas Instruments and/or its licensors do not warrant the accuracy or completeness of this specification or any information contained therein. Texas Instruments and/or its licensors do not warrant that this design will meet the specifications, will be suitable for your application or fit for any particular purpose, or will operate in an implementation. Texas Instruments and/or its licensors do not warrant that the design is production worthy. You should completely validate and test your design implementation to confirm the system functionality for your application.
- Engineer:
- Contact:
- © Texas Instruments

### Library data of the parts
C6 C9 C10 C12 C13 C72 C120 = CMP-0086440-1: Cap Ceramic 0.1uF 35V X5R 10% Pad SMD 0201 85C T/R; Manufacturer: Murata Electronics North America; AEC Qualified: No; SizeZ_mm: 0.33mm; Symbol Name: SYM-GRM033R6YA104KE14D; TempCo: 15%; RoHS: TRUE; ComponentLink1Description: Datasheet; ComponentLink1URL: https://search.murata.co.jp/Ceramy/image/img/A01X/G101/ENG/GRM033R6YA104KE14-01.pdf; PackageReference: 0201 (0603 Metric); PartNumber: GRM033R6YA104KE14D; Tolerance_%: 10%; VDC_V: 35V
C11 = CMP-0086446-1: 1µF ±20% 16V Ceramic Capacitor X5R 0201; Manufacturer: Samsung Electro-Mechanics; AEC Qualified: No; SizeZ_mm: 0.39mm; Symbol Name: SYM-CL03A105MO3NRNH; TempCo: 15%; RoHS: TRUE; ComponentLink1Description: Datasheet; ComponentLink1URL: http://www.samsungsem.com/global/front/downloadcms.do?path=%2F%2Fglobal%2F%2Fsupport%2F%2Fproduct-search%2F%2Fmlcc%2F%2F__icsFiles%2F%2Fafieldfile%2F%2F2018%2F%2F06%2F%2F21&fileName=CL03A105MO3NRNH.pdf; PackageReference: 0201; PartNumber: CL03A105MO3NRNH; Tolerance_%: 20%; VDC_V: 16V
C38 C39 = CMP-0087190-1: CAP CER 12PF 25V C0G/NP0 0201; Manufacturer: Johanson Technology Inc.; AEC Grade: Grade 1; AEC Qualified: Yes; SizeZ_mm: 0.33mm; Symbol Name: SYM-250R05L120JV4T; TempCo: 30ppm/°C; Tolerance_%: 5%; RoHS: TRUE; ComponentLink1Description: Datasheet; ComponentLink1URL: https://www.johansontechnology.com/downloads/catalog/johanson-technology-multi-layer-high-q-capacitors.pdf; PackageReference: 0201; PartNumber: 250R05L120JV4T; VDC_V: 25V
C125 = CMP-0086445-1: CAP CER 10000PF 25V X5R 0201; Manufacturer: Samsung Electro-Mechanics America, Inc; AEC Qualified: No; SizeZ_mm: 0.33mm; Symbol Name: SYM-CL03A103KA3NNNC; TempCo: 15%; Tolerance_%: 10%; RoHS: TRUE; ComponentLink1Description: Datasheet; ComponentLink1URL: http://www.samsungsem.com/global/front/downloadcms.do?path=%2F%2Fglobal%2F%2Fsupport%2F%2Fproduct-search%2F%2Fmlcc%2F%2F__icsFiles%2F%2Fafieldfile%2F%2F2018%2F%2F06%2F%2F19&fileName=CL03A103KA3NNNC.pdf; PackageReference: 0201; PartNumber: CL03A103KA3NNNC; VDC_V: 25V
J3 = CMP-0087187-1: CONN HDR 1.27MM R/A AU 4POS; Manufacturer: Harwin Inc.; ContactFinish: Gold; Current_A: 1A; Row_Count: 1; RoHS: TRUE; ComponentLink1Description: Datasheet; ComponentLink1URL: https://cdn.harwin.com/pdfs/M50-393.pdf; PackageReference: HDR4; PartNumber: M50-3930442; PinCount: 4; Symbol Name: SYM-M50-3930442
LD2 LD3 LD5 = CMP-0067682-2: as LD4 on sheet PROC106B_FLASH_USB_TO_UART; RoHS: Y; Color: Green; ComponentLink1Description: Datasheet link; ComponentLink1URL: http://www.kingbrightusa.com/images/catalog/SPEC/APHHS1005CGCK.pdf; PackageReference: 0402; PartNumber: APHHS1005CGCK; CompType: LED; MountType: SMT; SizeY_mm: 0.5; Type: ?; Value2: 2.1V; Value: Green
Q1 = CMP-0087176-1: MOSFET N-CH 100V 170MA SOT23-3; Manufacturer: Diodes Incorporated; AEC Qualified: No; ChMode: False; Rdson45_ohm: 6; SizeZ_mm: 1.1mm; Vgs_V: 20V; RoHS: TRUE; ComponentLink1Description: Datasheet; ComponentLink1URL: https://www.diodes.com/assets/Datasheets/ds30366.pdf; IdsMax_A: 170mA; PackageReference: SOT23; PartNumber: BSS123-7-F; Symbol Name: SYM-BSS123-7-F; VdsMax_V: 100V
R13 R42 R111 = CMP-0027072-1: RES, 220, 5%, 0.05 W, 0201; Manufacturer: Yageo America; AEC Category: Q200; AEC Qualified: N; EIA_Code: E24; Power_W: 50mW; SizeArea_mm2: 0.18; SizeX_mm: 0.6; SizeY_mm: 0.3; SizeZ_mm: 0.26; TempCo: 200 ppm/C; U/M: EA; Value2: 0.05W; Value_Code: 220R; VDC_V: 25V; RoHS: Y; AEC Grade: N/A; ComponentLink1Description: Datasheet link; ComponentLink1URL: http://www.yageo.com/documents/recent/PYu-RC_Group_51_RoHS_L_5.pdf; CompType: Resistor; LatestRevisionDate: 2017-03-09; MountType: SMT; PackageReference: 0201; PartNumber: RC0201JR-07220RL; Published: 2016-10-14; Publisher: Texas Instruments; Res_ohm: 220; Supplier 1: Digi-Key; Supplier 2: Mouser; Supplier Part Number 1: 311-220NCT-ND; Supplier Part Number 2: 603-RC0201JR-07220RL; Technology: Thick Film; Tolerance_%: 5%; Value1: 5%; ValueDisplayed: 220
R18 R77 R78 R80-R82 R93 R96 R98 R124 R125 R177 R178 = CMP-0088002-1: 10 kOhms ±0.5% 0.05W, 1/20W Chip Resistor 0201 (0603 Metric)  Thin Film; Manufacturer: Susumu; AEC Qualified: No; Power_W: 50mW; SizeZ_mm: 0.26mm; Symbol Name: SYM-RR0306P-103-D; TempCo: 25ppm/°C; VDC_V: 15V; RoHS: TRUE; ComponentLink1Description: Datasheet; ComponentLink1URL: https://www.susumu.co.jp/common/pdf/n_catalog_partition05_en.pdf; PackageReference: 0201; PartNumber: RR0306P-103-D; Technology: Thin Film; Tolerance_%: 0.5%
R38 R69 = CMP-0027745-1: RES, 4.99 k, 1%, 0.05 W, 0201; Manufacturer: Yageo America; AEC Category: Q200; AEC Qualified: N; EIA_Code: E96; Power_W: 50mW; SizeArea_mm2: 0.18; SizeX_mm: 0.6; SizeY_mm: 0.3; SizeZ_mm: 0.26; TempCo: 200 ppm/C; U/M: EA; Value2: 0.05W; Value_Code: 4k99; VDC_V: 25V; RoHS: Y; AEC Grade: N/A; ComponentLink1Description: Datasheet link; ComponentLink1URL: http://www.yageo.com/documents/recent/PYu-RC_Group_51_RoHS_L_5.pdf; CompType: Resistor; LatestRevisionDate: 2017-03-09; MountType: SMT; PackageReference: 0201; PartNumber: RC0201FR-074K99L; Published: 2016-10-14; Publisher: Texas Instruments; Res_ohm: 4.99k; Supplier 1: Digi-Key; Supplier 2: Mouser; Supplier Part Number 1: YAG2712CT-ND; Supplier Part Number 2: 603-RC0201FR-074K99L; Technology: Thick Film; Tolerance_%: 1%; Value1: 1%; ValueDisplayed: 4.99k
R51 R57 R67 R68 R70-R73 R97 R129 = CMP-0086442-2: RES SMD 0 OHM JUMPER 1/20W 0201; Manufacturer: Yageo; AEC Qualified: No; Power_W: 50mW; SizeZ_mm: 0.26mm; TempCo: 200ppm/°C; Tolerance_%: 5%; VDC_V: 25V; RoHS: TRUE; ComponentLink1Description: Datasheet; ComponentLink1URL: http://www.yageo.com/documents/recent/PYu-RC_Group_51_RoHS_L_10.pdf; PackageReference: 0201 (0603 Metric); PartNumber: RC0201JR-070RL; Technology: Thick Film
R107 R108 = CMP-0027137-1: RES, 510, 5%, 0.05 W, 0201; Manufacturer: Yageo America; AEC Category: Q200; AEC Qualified: N; EIA_Code: E24; Power_W: 50mW; SizeArea_mm2: 0.18; SizeX_mm: 0.6; SizeY_mm: 0.3; SizeZ_mm: 0.26; TempCo: 200 ppm/C; U/M: EA; Value2: 0.05W; Value_Code: 510R; VDC_V: 25V; RoHS: Y; AEC Grade: N/A; ComponentLink1Description: Datasheet link; ComponentLink1URL: http://www.yageo.com/documents/recent/PYu-RC_Group_51_RoHS_L_5.pdf; CompType: Resistor; LatestRevisionDate: 2017-03-09; MountType: SMT; PackageReference: 0201; PartNumber: RC0201JR-07510RL; Published: 2016-10-14; Publisher: Texas Instruments; Res_ohm: 510; Supplier 1: Digi-Key; Supplier 2: Mouser; Supplier Part Number 1: YAG2907CT-ND; Supplier Part Number 2: 603-RC0201JR-07510RL; Technology: Thick Film; Tolerance_%: 5%; Value1: 5%; ValueDisplayed: 510
SW2 SW3 = CMP-0002150-2: SWITCH TACTILE SPST-NO 0.05A 12V; Manufacturer: Omron Electronic Components; CurrentRating_mA: 50A; PositionCount: 1; SwitchFunction: Off-Mom; RoHS: Y; Circuit: SPST-NO; ComponentLink1Description: Datasheet URL; ComponentLink1URL: http://www.components.omron.com/components/web/PDFLIB.nsf/0/2DD3893C7DD33E9E862572900079E9D6/$file/B3U_1110.pdf; CompType: Switch; LatestRevisionDate: 2017-03-09; MountType: SMT; Orientation: Top Actuated; PackageReference: 3x1.6x2.5mm; PartNumber: B3U-1000P; Publisher: Texas Instruments; Supplier 1: Digi-Key; Supplier 2: Newark; Supplier 3: Mouser; Supplier Part Number 1: SW1020CT-ND; Supplier Part Number 2: 34M5295; Supplier Part Number 3: 653-B3U-1000P; VDC_V: 12V
TP15 = CMP-0078143-3: TEST POINT.  No entry in BOM.; CompType: Testpoint; Manufacturer: N/A; PackageReference: N/A; PartNumber: N/A; Library Reference: TESTPOINT
TP20 = CMP-0086474-1: PC Test Point, Loop Brass, Tin Plating 0.047" (1.19mm) Hole Diameter Mounting Type; Manufacturer: Keystone Electronics; RoHS: TRUE; ComponentLink1Description: Datasheet; ComponentLink1URL: https://www.keyelco.com/product-pdf.cfm?p=1307; ContactFinish: Tin; PackageReference: HDR1; PartNumber: 4953; PinCount: 1; Symbol Name: SYM-4953
U5 = CMP-0067398-2: Automotive Grade, 1.4V-Capable +/-0.5degC Temperature Sensor with Alert Function and I2C/SMBus, DRL0006A (SOT-OTHER-6); Alternate Manufacturer: Texas Instruments; CompType: IC; SizeArea_mm2: 2.56; SizeAreaWB_mm2: 6.76; SizeX_mm: 1.6; SizeZ_mm: 0.6; U/M: EA; RoHS: Y; ComponentLink1Description: Datasheet Link; ComponentLink1URL: http://www.ti.com/lit/ds/symlink/tmp112-q1.pdf; LatestRevisionDate: 2017-06-09; Manufacturer: Texas Instruments; MountType: SMT; PackageDescription: SOT-OTHER-6; PackageReference: DRL0006A; PartNumber: TMP112AQDRLRQ1; Publisher: Texas Instruments; SizeY_mm: 1.6
U6 = CMP-0087170-1: 8KB I2C SER EEPROM TSOT 23; Manufacturer: ON Semiconductor; SizeZ_mm: 1mm; RoHS: TRUE; ComponentLink1Description: Datasheet; ComponentLink1URL: https://www.onsemi.com/pub/Collateral/CAT24C01-D.PDF; PackageReference: TSOT-23-5; PartNumber: CAT24C08TDI-GT3; Symbol Name: SYM-CAT24C08TDI-GT3
U7 = CMP-0087171-1: IMU ACCEL/GYRO/MAG I2C 32BIT; Manufacturer: Hillcrest Laboratories, Inc.; SizeZ_mm: 1.18mm; RoHS: TRUE; ComponentLink1Description: Datasheet; ComponentLink1URL: https://www.hillcrestlabs.com/download/5a747b8d566d073a5d000536; PackageReference: LGA28; PartNumber: BNO085; Symbol Name: SYM-BNO085
U16 = CMP-0087998-2: AND Gate IC 1 Channel  6-SON (1x1); Manufacturer: Texas Instruments; TJmax_C: +150°C; PositionCount: 1; Number Of Inputs: 3; SizeZ_mm: 0.4mm; TaMax_C: +125°C; Max Supply Voltage: 5.5V; Min Supply Voltage: 1.65V; Standoff Height: 0mm; AEC Qualified: No; TaMin_C: -40°C; AEC Category: Q200; Datasheet Path: datasheets/IC_SN74LVC1G11DSFR.pdf; Lead Free: Yes; PackageReference: X2SON-6; helpURL: https://upverter.com/upn/revision/721ddc34b28c671c/; datasheet: http://www.ti.com/lit/ds/symlink/sn74lvc1g11.pdf; Mouser Part Number: 595-SN74LVC1G11DSFR; Digikey Part Number: 296-30121-1-ND; Logic Function Desc: AND; ComponentLink1URL: http://www.ti.com/lit/ds/symlink/sn74lvc1g11.pdf; Part Number: SN74LVC1G11DSFR; RoHS: TRUE; Number Of Outputs: 1; ComponentLink1Description: Datasheet; Mouser Description: Logic Gates Sgl 3-Inp Pos-AND Gate; Operating Temperature Range: -40°C to +125°C; Digikey Description: IC GATE AND 1CH 3-INP 6SON; ComponentLink2Description: Product Folder; ComponentLink2URL: http://www.ti.com/product/GPN; ComponentLink3Description: Online Datasheet; ComponentLink3URL: http://www.ti.com/product/GPN/datasheet; CompType: IC; PartNumber: SN74LVC1G11DSFR
Y4 = CMP-0088006-1: CRYSTAL 32.768KHZ 4PF SMD; Manufacturer: Abracon LLC; AEC Qualified: No; Frequency Tolerance: 20ppm; SizeZ_mm: 0.5mm; RoHS: TRUE; ComponentLink1Description: Datasheet; ComponentLink1URL: https://abracon.com/Resonators/ABS05W.pdf; Load Capacitance: 4pF; PackageReference: XTAL_SMT_1MM6_1MM0; PartNumber: ABS05W-32.768KHZ-D-2-T; Symbol Name: SYM-ABS05W-32.768KHZ-D-2-T

## Sheet PROC106B_Hardware.schdoc: HARDWARE
size 431 x 279 mm; Date: Not shown in title block; ApprovedBy: Not shown in title block; CheckedBy: Not shown in title block; Author: Not shown in title block; CompanyName: Not shown in title block; DrawnBy: Antony/Anand Ram; Engineer: Not shown in title block; Organization: Not shown in title block; Address1: Not shown in title block; Address2: Not shown in title block; Address3: Not shown in title block; Address4: Not shown in title block; DocumentNumber: 12; Revision: Use project parameter SCH_Rev; SheetNumber: 12; SheetTotal: 12; PageSetup: Record=PageOptions|CenterHorizontal=True|CenterVertical=True|PrintScale=1.00|XCorrection=1.00|YCorrection=1.00|PrintKind=0|BorderSize=5000000|LeftOffset=0|BottomOffset=0|Orientation=2|PaperLength=1000|PaperWidth=1000|Scale=100|PaperSource=15|PrintQuality=600|MediaType=1|DitherType=10|PaperKind=Letter|PrintScaleMode=1; CurrentTime: Not shown in title block; CurrentDate: Not shown in title block; Time: Not shown in title block; DocumentFullPathAndName: Not shown in title block; DocumentName: Not shown in title block; ModifiedDate: Not shown in title block; ImagePath: Not shown in title block
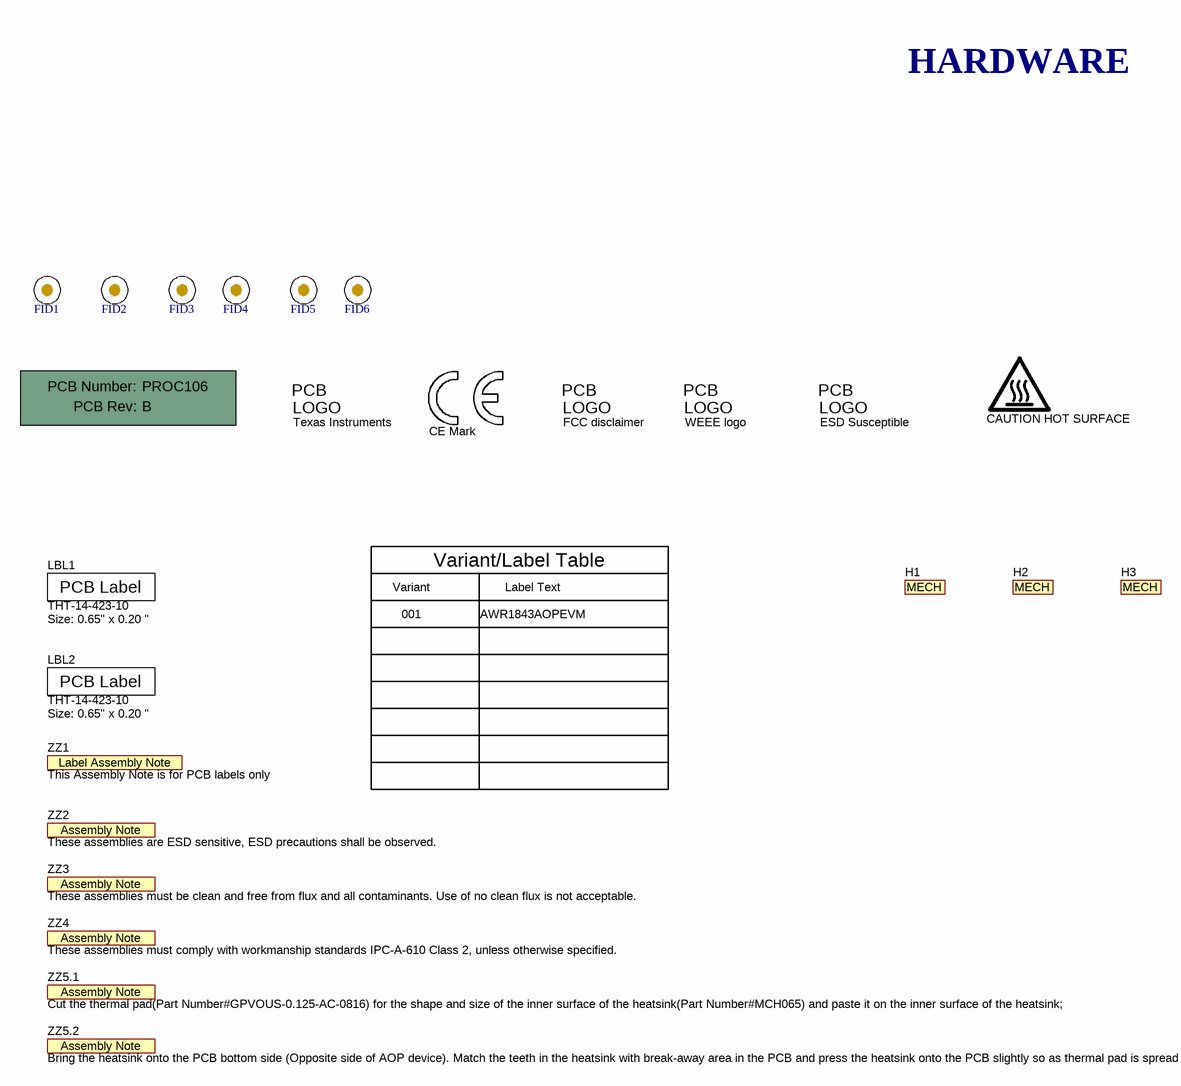
[diagram p4: PROC106B_Hardware.schdoc]

### Parts
!PCB  Printed Circuit Board  (value not drawn)  (mechanical)
CAUTION_HOT_SURFACE1  CAUTION HOT SURFACE  [IEC_HotSurface_Small]  (graphical)
ESD_Susceptible1  ESD Susceptible  [ESD_Overlay_Small]  (graphical)
FID1  Fiducial  [Fiducial6.4-20]  (value not drawn)
FID2  Fiducial  [Fiducial6.4-20]  (value not drawn)
FID3  Fiducial  [Fiducial6.4-20]  (value not drawn)
FID4  Fiducial  [Fiducial6.4-20]  (value not drawn)
FID5  Fiducial  [Fiducial6.4-20]  (value not drawn)
FID6  Fiducial  [Fiducial6.4-20]  (value not drawn)
H1  MechPart  (value not drawn)  (mechanical)
H2  MechPart  (value not drawn)  (mechanical)
H3  MechPart  (value not drawn)  (mechanical)
LBL1  THT-14-423-10  Note: Size: 0.65" x 0.20 "  [Label_650x200]  (graphical)
LBL2  THT-14-423-10  Note: Size: 0.65" x 0.20 "  [Label_650x200]  (graphical)
Logo1  Texas Instruments  [TI_Stacked_Overlay_Small]  (graphical)
Logo2  CE Mark  [CE_Mark_5mm]  (graphical)
Logo3  FCC disclaimer  [FCC_disclaimer]  (graphical)
Logo4  WEEE logo  [WEEE_Minimum]  (graphical)
ZZ1  This Assembly Note is for PCB labels only  [AssemblyNoteLabel]  (no BOM)
ZZ2  These assemblies are ESD sensitive, ESD precautions shall be observed.  [AssemblyNote]  (no BOM)
ZZ3  These assemblies must be clean and free from flux and all contaminants. Use of no clean flux is not acceptable.  [AssemblyNote]  (no BOM)
ZZ4  These assemblies must comply with workmanship standards IPC-A-610 Class 2, unless otherwise specified.  [AssemblyNote]  (no BOM)
ZZ5.1  Cut the thermal pad(Part Number#GPVOUS-0.125-AC-0816) for the shape and size of the inner surface of the heatsink(Part Number#MCH065) and paste it on the inner surface of the heatsink;  [AssemblyNote]  (no BOM)
ZZ5.2  Bring the heatsink onto the PCB bottom side (Opposite side of AOP device). Match the teeth in the heatsink with break-away area in the PCB and press the heatsink onto the PCB slightly so as thermal pad is spread all over the area  [AssemblyNote]  (no BOM)

### Notes on the sheet
- HARDWARE
- Variant/Label Table
- Variant
- 001
- Label Text
- AWR1843AOPEVM
- Drawn By:
- SVN Rev:
- Number:
- TID #:
- Orderable:
- Rev:
- Sheet Title:
- File:
- Project Title:
- Designed for:
- Assembly Variant:
- Mod. Date:
- Sheet:
- Size:
- of
- B
- http://www.ti.com
- Texas Instruments and/or its licensors do not warrant the accuracy or completeness of this specification or any information contained therein. Texas Instruments and/or its licensors do not warrant that this design will meet the specifications, will be suitable for your application or fit for any particular purpose, or will operate in an implementation. Texas Instruments and/or its licensors do not warrant that the design is production worthy. You should completely validate and test your design implementation to confirm the system functionality for your application.
- Engineer:
- Contact:
- © Texas Instruments
- (in symbol CMP-0003616-3) Label Assembly Note
- (in symbol CMP-0003618-2) PCB Number:; PCB Rev:
- (in symbol CMP-0003625-1) PCB Label
- (in symbol CMP-0074769-1) PCB; LOGO
- (in symbol CMP-0074838-1) PCB; LOGO
- (in symbol CMP-0074840-1) PCB; LOGO
- (in symbol CMP-0074847-1) PCB; LOGO
- (in symbol CMP-0080604-2) MECH

### Library data of the parts
!PCB = CMP-0003618-2: Manufacturer: Any; PartNumber: PROC106; CompType: PCB; RoHS: O; MountType: N/A; Publisher: Texas Instruments; LatestRevisionDate: 2017-03-09; Key: PCB
CAUTION_HOT_SURFACE1 = CMP-0074837-1: IEC 61010-1 Hot Surface Warning; Library Reference: IEC_HotSurface; SymbolCreator: a0412235; Publisher: Texas Instruments; SymbolVersion: 2011-08-22; Published: 2009-03-03; Lib Reference: IEC_HotSurface; LatestRevisionDate: 2017-07-06; PartNumber: CAUTION HOT SURFACE
ESD_Susceptible1 = CMP-0074840-1: ESD Susceptible Symbol; Library Reference: Logo; SymbolCreator: a0412235; Lib Reference: ESD_Susceptible; Publisher: Texas Instruments; SymbolVersion: 2011-08-22; Published: 2009-03-03; LatestRevisionDate: 2017-07-06; PartNumber: ESD Susceptible
FID1-FID6 = CMP-0077181-1: Fiducial mark.  There is nothing to buy or mount.; CompType: Fiducial; Manufacturer: N/A; MountType: N/A; PackageReference: N/A; PartNumber: N/A; ClassName: FiducialMark; Library Reference: Fiducial
H1 = CMP-0080604-2: AWR1843AOPEVM Heatsink; Manufacturer: Any; PartNumber: MCH065; Alternate PartNumber: 160021010002; CompType: Mechanical; ComponentLink1URL: Paste URL for datasheet here; RoHS: TRUE; ComponentLink1Description: Datasheet Link
H2 = CMP-0080604-2: Thermal Pad Pink 406.40mm x 203.20mm Rectangular Adhesive - One Side; Manufacturer: Bergquist; PartNumber: GPVOUS-0.125-AC-0816; CompType: Mechanical; ComponentLink1URL: Paste URL for datasheet here; RoHS: TRUE; ComponentLink1Description: Datasheet Link
H3 = CMP-0080604-2: AWR1843AOPEVM Mounting stand; Manufacturer: Any; PartNumber: MCH066; Alternate PartNumber: 160021010001; CompType: Mechanical; ComponentLink1URL: Paste URL for datasheet here; RoHS: TRUE; ComponentLink1Description: Datasheet Link
LBL1 LBL2 = CMP-0003625-1: Thermal Transfer Printable Labels, 0.650" W x 0.200" H - 10,000 per roll; Manufacturer: Brady; CompType: Label; ClassName: Label; PartNumber: THT-14-423-10; RoHS: Y; PackageReference: PCB Label 0.650 x 0.200 inch; MountType: N/A; ComponentLink1Description: Web Page; ComponentLink1URL: http://www.bradyid.com/bradyid/pdpv/THT-14-423-10.html; Publisher: Texas Instruments; LatestRevisionDate: 2017-03-09; Supplier 1: Newark; Supplier Part Number 1: 97C5133; Supplier 2: Farnell; Supplier Part Number 2: 2065596; Key: THT-14-423-10
Logo1 = CMP-0074838-1: Texas Instrument Corporate Signature; SymbolCreator: a0412235; Lib Reference: TI_Logo; Library Reference: Logo; SymbolVersion: 2011-08-22; Published: 2009-03-03; Publisher: Texas Instruments; ClassName: Logo; LatestRevisionDate: 2017-07-06; PartNumber: Texas Instruments
Logo2 = CMP-0074844-1: SymbolCreator: a0412235; Published: 2009-03-03; Publisher: Texas Instruments; LatestRevisionDate: 2017-07-06; Lib Reference: CE Mark; PartNumber: CE Mark; Library Reference: CE Mark
Logo3 = CMP-0074847-1: FCC_disclaimer; Library Reference: Logo; Published: 2009-03-03; Publisher: Texas Instruments; LatestRevisionDate: 2017-07-06; Lib Reference: FCC_disclaimer; PartNumber: FCC disclaimer
Logo4 = CMP-0074769-1: Library Reference: WEEE logo; Lib Reference: WEEE logo; PartNumber: WEEE logo
ZZ1 = CMP-0003616-3: CompType: AssemblyNote; ClassName: AssemblyNote; Publisher: Texas Instruments; LatestRevisionDate: 2017-03-09; Key: AssemblyNoteLabel
ZZ2 = CMP-0077236-1: CompType: AssemblyNote; ClassName: AssemblyNote; Publisher: Texas Instruments; LatestRevisionDate: 2017-08-10; Key: AssemblyNote
ZZ3 = CMP-0077237-1: CompType: AssemblyNote; ClassName: AssemblyNote; Publisher: Texas Instruments; LatestRevisionDate: 2017-08-10; Key: AssemblyNote
ZZ4 ZZ5.2 = CMP-0077238-1: CompType: AssemblyNote; ClassName: AssemblyNote; Publisher: Texas Instruments; LatestRevisionDate: 2017-08-10; Key: AssemblyNote
ZZ5.1 = CMP-0077238-1: Cut the thermal pad(Part Number#GPVOUS-0.125-AC-0816) for the shape and size of the inner surface of the heatsink(Part Number#160018120021) and paste it on the inner surface of the heatsink;; CompType: AssemblyNote; ClassName: AssemblyNote; Publisher: Texas Instruments; LatestRevisionDate: 2017-08-10; Key: AssemblyNote

## Nets that join several sheets
5V_IN: PROC106B_FLASH_USB_TO_UART (C1.2 C4.1 D1.1 R64.1), PROC106B_RST_GPIOs_I2C (R107.1)
GND: PROC106B_AOP_PWR (113 pins), PROC106B_AOP_IO (9 pins), PROC106B_FLASH_USB_TO_UART (21 pins), PROC106B_RST_GPIOs_I2C (30 pins)
PMIC_3V3: PROC106B_AOP_PWR (5 pins), PROC106B_AOP_IO (12 pins), PROC106B_FLASH_USB_TO_UART (15 pins)
AR_GPIO_1: PROC106B_AOP_IO (U2.L3), PROC106B_RST_GPIOs_I2C (R129.2)
AR_GPIO_2: PROC106B_AOP_IO (U2.K3), PROC106B_RST_GPIOs_I2C (LD3.1)
AR_MSS_LOGGER: PROC106B_AOP_IO (U2.E2), PROC106B_FLASH_USB_TO_UART (R61.1)
AR_NRST: PROC106B_AOP_IO (C130.2 R59.1 TP14.1 U2.U11), PROC106B_RST_GPIOs_I2C (R108.1 U16.4)
AR_QSPI_CLK: PROC106B_AOP_IO (U2.H2), PROC106B_FLASH_USB_TO_UART (R47.1)
AR_QSPI_CS: PROC106B_AOP_IO (U2.J2), PROC106B_FLASH_USB_TO_UART (R43.1 U9.1)
AR_QSPI_D0: PROC106B_AOP_IO (U2.H3), PROC106B_FLASH_USB_TO_UART (R6.1)
AR_QSPI_D1: PROC106B_AOP_IO (U2.G2), PROC106B_FLASH_USB_TO_UART (R46.1)
AR_QSPI_D2: PROC106B_AOP_IO (U2.J3), PROC106B_FLASH_USB_TO_UART (R44.1 R48.1)
AR_QSPI_D3: PROC106B_AOP_IO (U2.K2), PROC106B_FLASH_USB_TO_UART (R45.1 R49.1)
AR_RS232RX: PROC106B_AOP_IO (R5.2 U2.V16), PROC106B_FLASH_USB_TO_UART (U18.10)
AR_RS232TX: PROC106B_AOP_IO (R4.2 U2.U16), PROC106B_FLASH_USB_TO_UART (U18.6)
AR_SCL: PROC106B_AOP_IO (R8.1 U2.G3), PROC106B_RST_GPIOs_I2C (J3.2 R51.1 R67.1 R70.2)
AR_SDA: PROC106B_AOP_IO (R7.1 U2.G1), PROC106B_RST_GPIOs_I2C (J3.3 R57.1 R68.1 R71.2)

## Assembly variants
001: not fitted C5 C7 C8 C9 C10 C11 C13 C15 C16 C17 C18 C38 C39 C104 C114 C115 C116 C118 C119 FID1 FID2 FID3 FID4 FID5 FID6 J4 J6 R10 R11 R18 R20 R30 R66 R70 R71 R72 R73 R76 R77 R78 R79 R80 R81 R82 R88 R92 R93 R96 R97 R98 R103 R106 R115 R130 R132 R133 R135 R137 R138 R140 R160 R166 R168 R180 R181 R182 R183 R184 R185 R188 R189 U4 U7 U14 Y4